# Altium schematic sheet Gate_Driver_cct.SchDoc
size A3
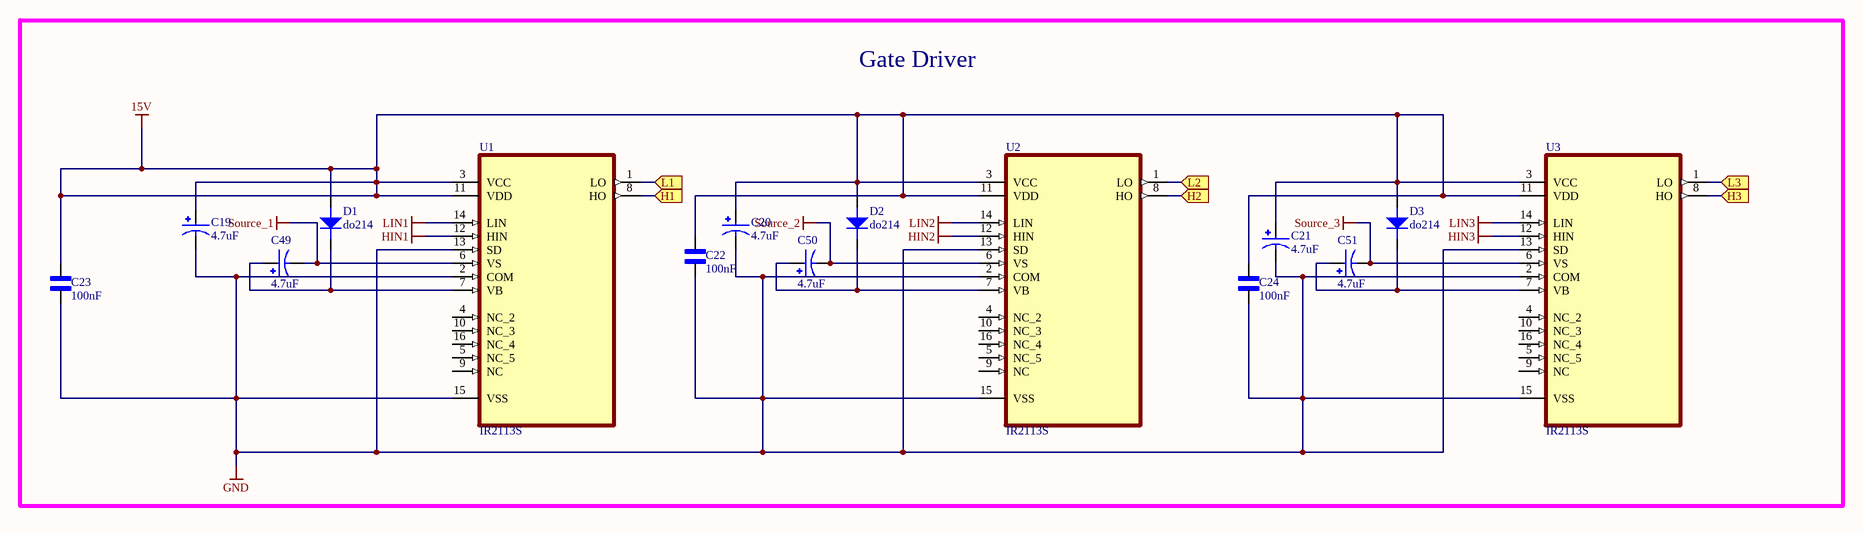
[diagram p0: Gate_Driver_cct.SchDoc]

## Parts
C19  4.7uF  [CAP ALSMD POLY 4.3MM H5.5MM]
C20  4.7uF  [CAP ALSMD POLY 4.3MM H5.5MM]
C21  4.7uF  [CAP ALSMD POLY 4.3MM H5.5MM]
C22  100nF  [C-0805W]
C23  100nF  [C-0805W]
C24  100nF  [C-0805W]
C49  4.7uF  [CAP ALSMD POLY 4.3MM H5.5MM]
C50  4.7uF  [CAP ALSMD POLY 4.3MM H5.5MM]
C51  4.7uF  [CAP ALSMD POLY 4.3MM H5.5MM]
D1  do214  [DO-214AC]
D2  do214  [DO-214AC]
D3  do214  [DO-214AC]
U1  IR2113S  [SOIC127P1032X265-16N]
U2  IR2113S  [SOIC127P1032X265-16N]
U3  IR2113S  [SOIC127P1032X265-16N]

## Blocks framed on the sheet
Gate Driver: C19-C24 C49-C51 D1-D3 U1-U3

## Ports
H1 (in), H2 (in), H3 (in), L1 (in), L2 (in), L3 (in)

## Nets
15V: C19.1 C20.1 C21.1 C22.1 C23.1 C24.1 D1.a D2.a D3.a U1.3(VCC) U1.11(VDD) U2.3(VCC) U2.11(VDD) U3.3(VCC) U3.11(VDD)
GND: C19.2 C20.2 C21.2 C22.2 C23.2 C24.2 U1.2(COM) U1.13(SD) U1.15(VSS) U2.2(COM) U2.13(SD) U2.15(VSS) U3.2(COM) U3.13(SD) U3.15(VSS)
HIN1: U1.12(HIN)
HIN2: U2.12(HIN)
HIN3: U3.12(HIN)
LIN1: U1.14(LIN)
LIN2: U2.14(LIN)
LIN3: U3.14(LIN)
Source_1: C49.2 U1.6(VS)
Source_2: C50.2 U2.6(VS)
Source_3: C51.2 U3.6(VS)
H1: U1.8(HO) ; port H1
H2: U2.8(HO) ; port H2
H3: U3.8(HO) ; port H3
L1: U1.1(LO) ; port L1
L2: U2.1(LO) ; port L2
L3: U3.1(LO) ; port L3
NetC49_1: C49.1 D1.k U1.7(VB)
NetC50_1: C50.1 D2.k U2.7(VB)
NetC51_1: C51.1 D3.k U3.7(VB)

Not connected (* = marked no-connect by the designer): U1 4(NC_2) 5(NC_5) 9(NC) 10(NC_3) 16(NC_4); U2 4(NC_2) 5(NC_5) 9(NC) 10(NC_3) 16(NC_4); U3 4(NC_2) 5(NC_5) 9(NC) 10(NC_3) 16(NC_4)

## Library data of the parts
C19-C21 C49-C51 = CAP 4.7uF
C22-C24 = CAP 100nF 50V SMT 0805: WCAP-CSGP General Purpose MLCC; SMT 0805; X7R; 100nF 10%; 50V; -55C to +125C; Tech. PN X7R0805104K050DFCT10000; MF: Wurth Electronics Inc; MP: 885012207098; Availability: Warning; Mouser-Purchase-URL: https://snapeda.com/shop?store=Mouser&id=4217223; Price: None; DigiKey-Purchase-URL: https://snapeda.com/shop?store=DigiKey&id=4217223; Package: 0805 Wurth Electronics; Value: *; SnapEDA_Link: https://www.snapeda.com/parts/885012207098/Wurth%20Electronics%20Inc/view-part/4217223/?ref=snap; BuyPart: https://www.snapeda.com/parts/885012207098/Wurth%20Electronics%20Inc/view-part/4217223/?ref=eda
D1-D3 = do214: DIODE FAST SWITCHING Single 150mA 75V SMT SOD323
U1-U3 = IR2113S: Half-Bridge Gate Driver IC Non-Inverting 16-SOIC; MF: Infineon Technologies; Value: *; SnapEDA_Link: https://www.snapeda.com/parts/IR2113S/Infineon%20Technologies/view-part/577803/?ref=snap; Package: SOIC-16 Infineon; MP: IR2113S; Availability: Unavailable; Price: None